# Altium schematic sheet LD_driver.SchDoc
size 420 x 297 mm; Address1: Address1; Address2: Address2; Address3: Address3; Address4: Address4; DocumentNumber: *Э3; SheetNumber: 5; SheetTotal: 11; DocumentType: Схема электрическая *
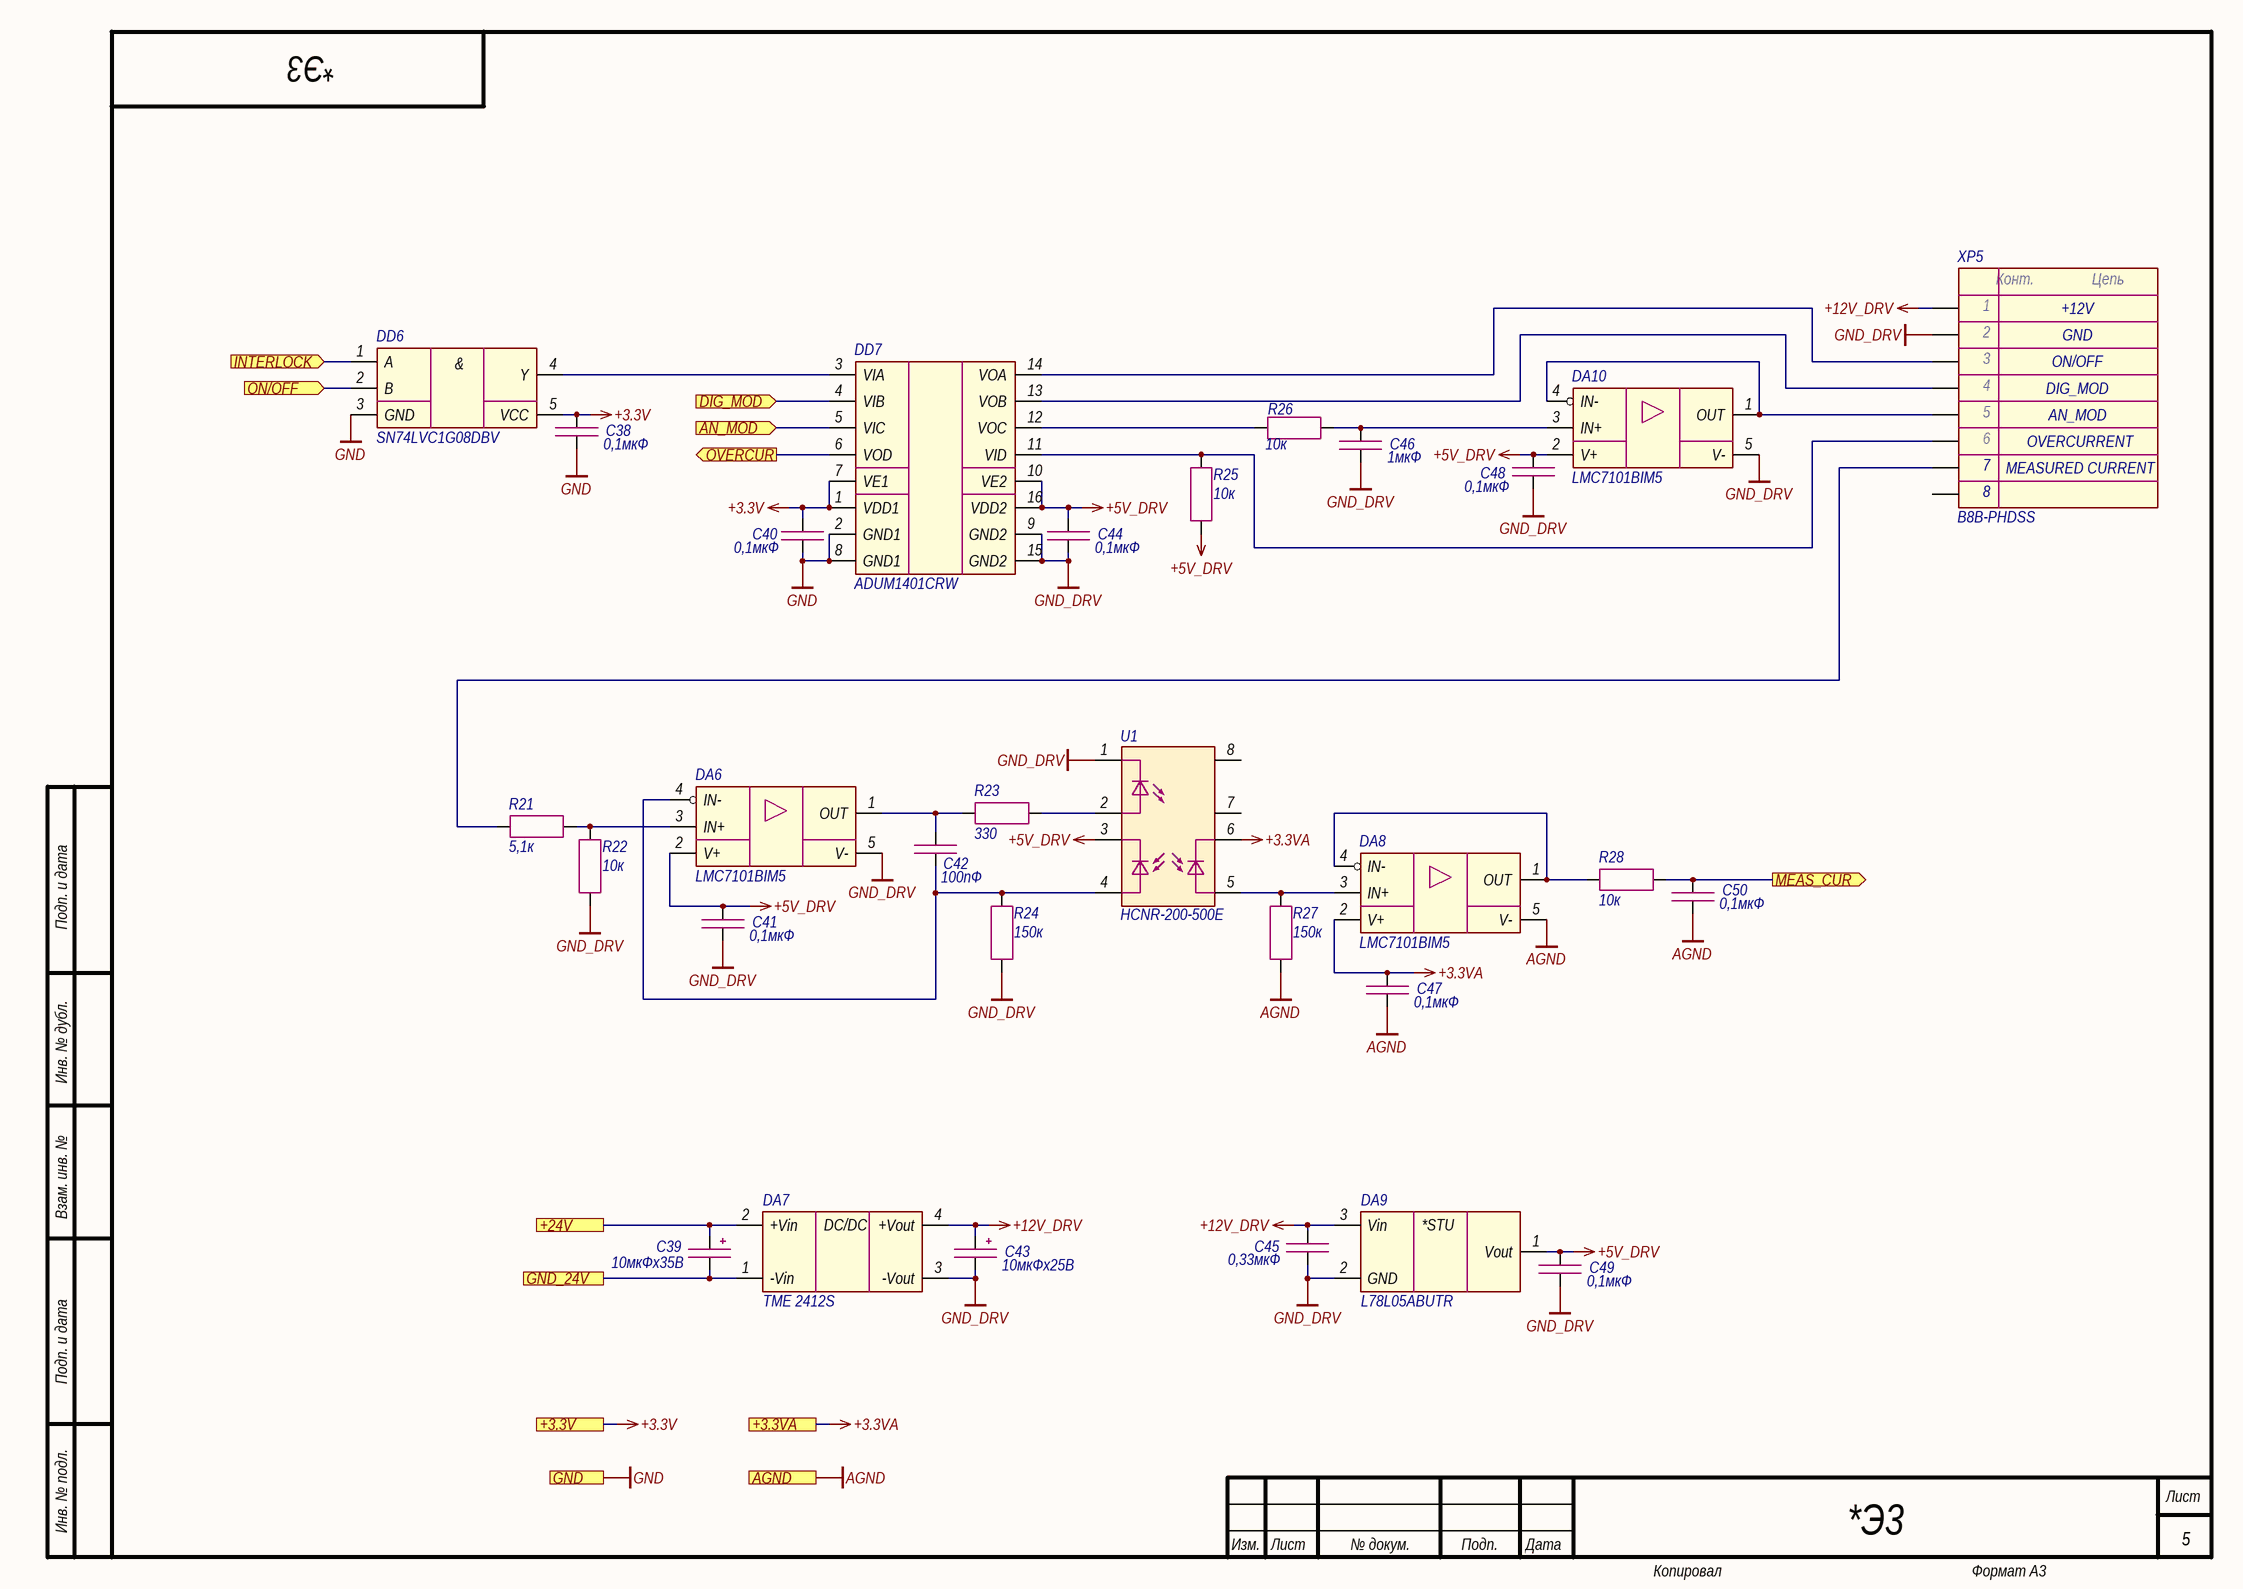
[diagram p0: LD_driver.SchDoc]

## Parts
C38  0,1мкФ  [CAP_0603]
C39  10мкФх35B  [CAP_C]
C40  0,1мкФ  [CAP_0603]
C41  0,1мкФ  [CAP_0603]
C42  100пФ  [CAP_0603]
C43  10мкФх25B  [CAP_B]
C44  0,1мкФ  [CAP_0603]
C45  0,33мкФ  [CAP_0805]
C46  1мкФ  [CAP_0603]
C47  0,1мкФ  [CAP_0603]
C48  0,1мкФ  [CAP_0603]
C49  0,1мкФ  [CAP_0603]
C50  0,1мкФ  [CAP_0603]
DA6  LMC7101BIM5  [SOT-23-5]
DA7  TME 2412S  [TME (SIP-4)]
DA8  LMC7101BIM5  [SOT-23-5]
DA9  L78L05ABUTR  [SOT-89]
DA10  LMC7101BIM5  [SOT-23-5]
DD6  SN74LVC1G08DBV  [SOT-23-5]
DD7  ADUM1401CRW  [SOIC-16W]
R21  5,1к  [RES_0603]
R22  10к  [RES_0603]
R23  330  [RES_0603]
R24  150к  [RES_0603]
R25  10к  [RES_0603]
R26  10к  [RES_0603]
R27  150к  [RES_0603]
R28  10к  [RES_0603]
U1  HCNR-200-500E  [HCNR200]
XP5  B8B-PHDSS  [B8B-PHDSS]

## Ports
+3.3V (see Main[2C], Ethernet[3D], Fiber_interlock[2C], Hardwiring[3D], Power_supply[2D], Protection[2C]), +3.3VA (see Main[2C], Hardwiring[4D], Thermistor[2C]), +24V (see Main[1C], Hardwiring[3C], Indication[1C], Power_supply[2C]), AGND (see Main[2C], Hardwiring[4D], Photodiode[1C], Thermistor[2C]), AN_MOD (in, see Main[1C]), DIG_MOD (in, see Main[1C]), GND (see Main[2C], Ethernet[3D], Fiber_interlock[2C], Guide_laser[1C], Hardwiring[3D], Indication[1C], Power_supply[2D], Protection[2C]), GND_24V (see Main[1C], Hardwiring[3C], Indication[1C], Power_supply[2C]), INTERLOCK (in, see Main[1B], Power_supply[1A], Protection[4B]), MEAS_CUR (out, see Main[2B]), ON/OFF (in, see Main[1B]), OVERCUR (out, see Main[2B])

## Nets
+3.3V: C38.1 C40.1 DD6.5(VCC) DD7.1(VDD1) DD7.7(VE1) ; port +3.3V
+3.3VA: C47.1 DA8.2(V+) U1.6 ; port +3.3VA
+5V_DRV: C41.1 C44.1 C48.1 C49.1 DA6.2(V+) DA9.1(Vout) DA10.2(V+) DD7.10(VE2) DD7.16(VDD2) R25.2 U1.3
+12V_DRV: C43.1 C45.2 DA7.4(+Vout) DA9.3(Vin) XP5.1
AGND: C47.2 C50.2 DA8.5(V-) R27.2 ; port AGND
GND: C38.2 C40.2 DD6.3(GND) DD7.2(GND1) DD7.8(GND1) ; port GND
GND_DRV: C41.2 C43.2 C44.2 C45.1 C46.2 C48.2 C49.2 DA6.5(V-) DA7.3(-Vout) DA9.2(GND) DA10.5(V-) DD7.9(GND2) DD7.15(GND2) R22.2 R24.2 U1.1 XP5.2
+24V: C39.1 DA7.2(+Vin) ; port +24V
AN_MOD: DD7.5(VIC) ; port AN_MOD
DIG_MOD: DD7.4(VIB) ; port DIG_MOD
GND_24V: C39.2 DA7.1(-Vin) ; port GND_24V
INTERLOCK: DD6.1(A) ; port INTERLOCK
MEAS_CUR: C50.1 R28.2 ; port MEAS_CUR
ON/OFF: DD6.2(B) ; port ON/OFF
OVERCUR: DD7.6(VOD) ; port OVERCUR
NetC42_1: C42.1 DA6.1(OUT) R23.1
NetC42_2: C42.2 DA6.4(IN-) R24.1 U1.4
NetC46_1: C46.1 DA10.3(IN+) R26.2
NetDA6_3: DA6.3(IN+) R21.2 R22.1
NetDA8_1: DA8.1(OUT) DA8.4(IN-) R28.1
NetDA8_3: DA8.3(IN+) R27.1 U1.5
NetDA10_1: DA10.1(OUT) DA10.4(IN-) XP5.5
NetDD6_4: DD6.4(Y) DD7.3(VIA)
NetDD7_11: DD7.11(VID) R25.1 XP5.6
NetDD7_12: DD7.12(VOC) R26.1
NetDD7_13: DD7.13(VOB) XP5.4
NetDD7_14: DD7.14(VOA) XP5.3
NetR21_1: R21.1 XP5.7
NetR23_2: R23.2 U1.2

Not connected (* = marked no-connect by the designer): U1 7 8; XP5 8

## Notes on the sheet
- +12V
- GND
- ON/OFF
- DIG_MOD
- AN_MOD
- OVERCURRENT
- MEASURED CURRENT
- Подп. и дата
- Инв. № дубл.
- Взам. инв. №
- Инв. № подл.
- Изм.
- Лист
- № докум.
- Подп.
- Дата
- Копировал
- Формат А3
- (in symbol Connector-8) Конт.; Цепь
- (in symbol LD2981ABU50TR) *STU
- (in symbol SN74LVC1G08) &
- (in symbol TME) DC/DC

## Library data of the parts
C38 C40 C41 C44 C47-C50 = Capacitor: Manufacturer: Murata; Model: GRM188R71H104KA93D; Value: 0,1мкФ; Document: *
C39 = Capacitor_Polar: Model: TECAP, 10 мкФ, 35 В, тип C, 10%; Value: 10мкФх35B; Document: *; Manufacturer: *
C42 = Capacitor: Manufacturer: Murata; Model: GRM1885C1H101JA01D; Value: 100пФ; Document: *
C43 = Capacitor_Polar: Model: TECAP, 10 мкФ, 25 В, тип B, 10%; Value: 10мкФх25B; Document: *; Manufacturer: *
C45 = Capacitor: Manufacturer: Murata; Model: GRM219R71H334KA88D; Value: 0,33мкФ; Document: *
C46 = Capacitor: Manufacturer: Murata; Model: GRM188R61H105KAALD; Value: 1мкФ; Document: *
DA6 DA8 DA10 = LMC7101: Manufacturer: Texas Instruments; Model: LMC7101BIM5; Document: *
DA7 = TME: Manufacturer: Traco Power; Model: TME 2412S; Document: *
DA9 = LD2981ABU50TR: Manufacturer: STMicroelectronics; Model: L78L05ABUTR; Document: *
DD6 = SN74LVC1G08: Manufacturer: Texas Instruments; Model: SN74LVC1G08DBV; Document: *
DD7 = ADUM1401: Manufacturer: Analog Devices; Model: ADUM1401CRW; Document: *
R21 = Resistor: Manufacturer: Yageo; Model: RC0603FR-075K1L; Value: 5,1к; Document: *
R22 R25 R26 R28 = Resistor: Manufacturer: Yageo; Model: RC0603FR-0710KL; Value: 10к; Document: *
R23 = Resistor: Manufacturer: Yageo; Model: RC0603FR-07330RL; Value: 330; Document: *
R24 R27 = Resistor: Manufacturer: Yageo; Model: RC0603FR-07150KL; Value: 150к; Document: *
U1 = HCNR200: Manufacturer: Avago; Model: HCNR-200-500E; Document: *
XP5 = Connector-8: Manufacturer: JST; Model: B8B-PHDSS; Document: *